# Altium schematic sheet 09- I2C, LEDs And Push Button.SchDoc: I2C LEDs And Push Buttons
size A3; Page Number: 7; Page Size: B; Page Count: 14; Board Rev: B; Project Name: CrossLink-NX Evaluation Board; RevCode: 1.0; Doc: 305-PD-19-0819; DsnPath: C:\Users\HAltinkilit\Downloads\Crosslink-NX-Design-Files\CrossLink-NX-Eval-Brd-Schematic-RevB-191122.DSN; SchematicName: SCHEMATIC1; PageName: 07 - I2C, LEDs And Push Button; PageSize: B; TopSchematic: True
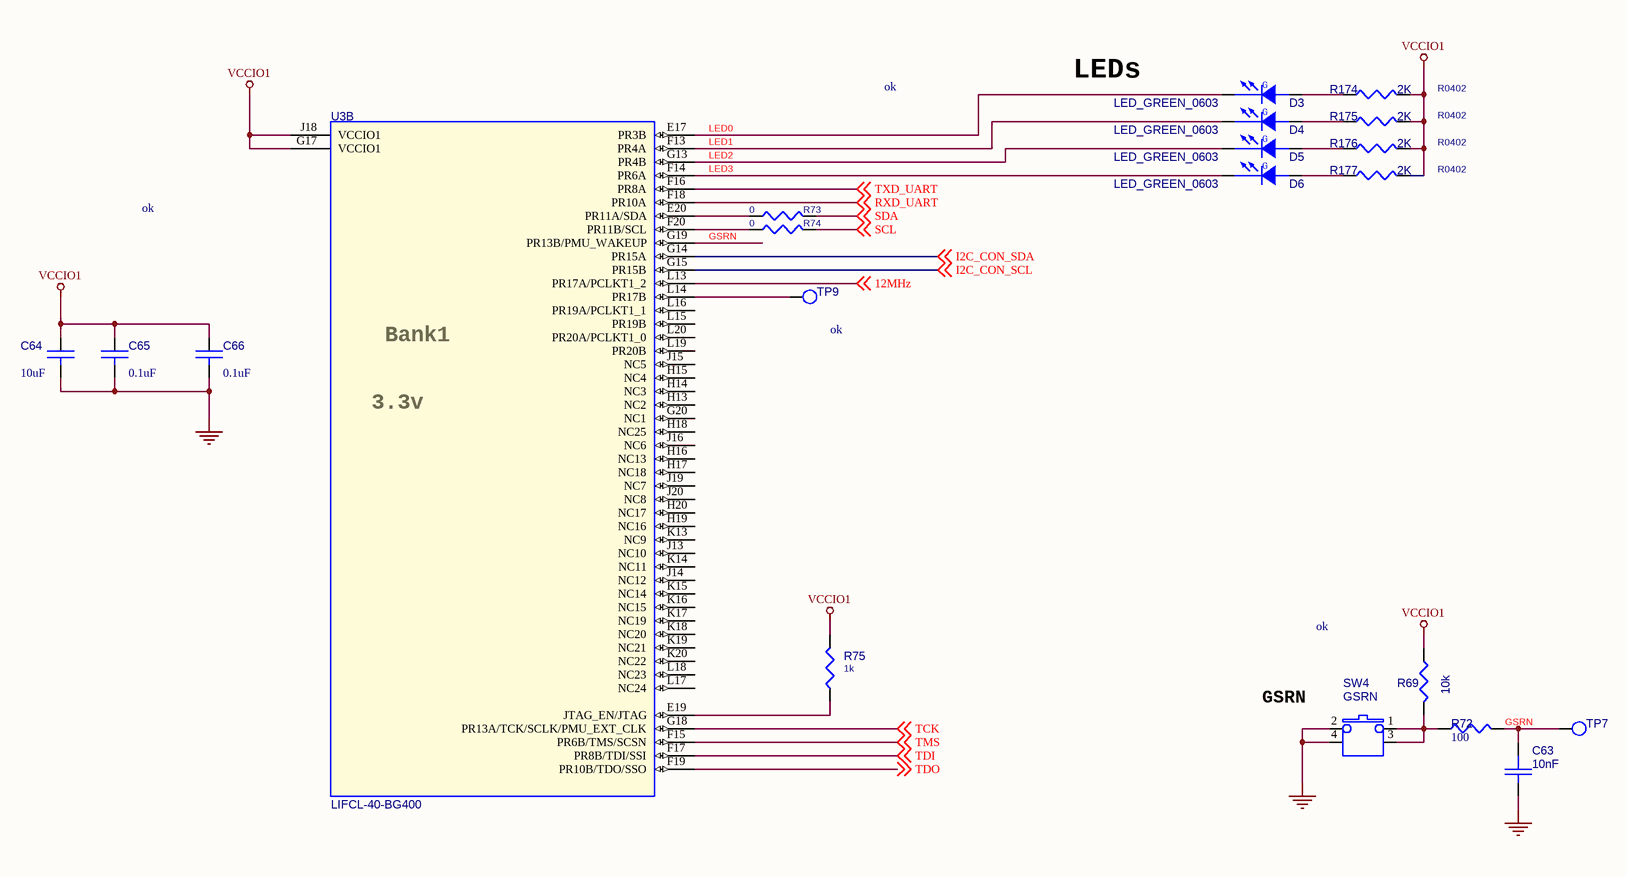
[diagram p0: 09- I2C, LEDs And Push Button.SchDoc]

## Parts
C63  10nF  [RLP-130-A]
C64  10uF  [C0603]
C65  0.1uF  [C0201]
C66  0.1uF  [C0201]
D3  LED_GREEN_0603  [APT1608]
D4  LED_GREEN_0603  [APT1608]
D5  LED_GREEN_0603  [APT1608]
D6  LED_GREEN_0603  [APT1608]
R69  10k  [R0402]
R72  100  [R0402]
R73  0  [R0402]
R74  0  [R0402]
R75  1k  [R0402]
R174  2K  [R0402]
R175  2K  [R0402]
R176  2K  [R0402]
R177  2K  [R0402]
SW4  GSRN  [4psmd_switch]
TP7  TestPoint  [TP_1MM]  (value not drawn)
TP9  TestPoint  [TP_1MM]  (value not drawn)
U3  LIFCL-40-BG400  [LIFCL-40-BG400]  (part B of 15)

## Nets
GND: C63.2 C64.2 C65.2 C66.2 SW4.2 SW4.4
VCCIO1: C64.1 C65.1 C66.1 R69.1 R75.2 R174.2 R175.2 R176.2 R177.2 U3.G17(VCCIO1) U3.J18(VCCIO1)
12MHz: U3.L13(PR17A/PCLKT1_2) ; off-sheet 12MHz
GSRN: C63.1 R72.2 TP7.1(TP) U3.G19(PR13B/PMU_WAKEUP)
I2C_CON_SCL: U3.G15(PR15B) ; off-sheet I2C_CON_SCL
I2C_CON_SDA: U3.G14(PR15A) ; off-sheet I2C_CON_SDA
LED0: D3.1(CATHODE) U3.E17(PR3B)
LED1: D4.1(CATHODE) U3.F13(PR4A)
LED2: D5.1(CATHODE) U3.G13(PR4B)
LED3: D6.1(CATHODE) U3.F14(PR6A)
RXD_UART: U3.F18(PR10A) ; off-sheet RXD_UART
SCL: R74.1 ; off-sheet SCL
SDA: R73.1 ; off-sheet SDA
TCK: U3.G18(PR13A/TCK/SCLK/PMU_EXT_CLK) ; off-sheet TCK
TDI: U3.F17(PR8B/TDI/SSI) ; off-sheet TDI
TDO: U3.F19(PR10B/TDO/SSO) ; off-sheet TDO
TMS: U3.F15(PR6B/TMS/SCSN) ; off-sheet TMS
TXD_UART: U3.F16(PR8A) ; off-sheet TXD_UART
NetD3_2: D3.2(ANODE) R174.1
NetD4_2: D4.2(ANODE) R175.1
NetD5_2: D5.2(ANODE) R176.1
NetD6_2: D6.2(ANODE) R177.1
NetR69_2: R69.2 R72.1 SW4.1 SW4.3
NetR73_2: R73.2 U3.E20(PR11A/SDA)
NetR74_2: R74.2 U3.F20(PR11B/SCL)
NetR75_1: R75.1 U3.E19(JTAG_EN/JTAG)
NetTP9_1: TP9.1(TP) U3.L14(PR17B)

Not connected (* = marked no-connect by the designer): U3 G20(NC1) H13(NC2) H14(NC3) H15(NC4) H16(NC13) H17(NC18) H18(NC25) H19(NC16) H20(NC17) J13(NC10) J14(NC12) J15(NC5) J16(NC6) J19(NC7) J20(NC8) K13(NC9) K14(NC11) K15(NC14) K16(NC15) K17(NC19) K18(NC20) K19(NC21) K20(NC22) L15(PR19B) L16(PR19A/PCLKT1_1) L17(NC24) L18(NC23) L19(PR20B) L20(PR20A/PCLKT1_0)

## Notes on the sheet
- LEDs
- ok
- (near U3) Bank1
- (near TP9) ok
- (near U3) 3.3v
- (near SW4) GSRN
- Proje/Project:
- Sayfa Adı/Document Name:
- Çizilme Tarihi/Drawing Date
- Umit KAYACIK
- Tasarlayan/Designed By
- Sayfa/Sheet:
- Revision:
- of
- Son Güncelleme/Last Edit Date
- Kontrol eden/Checked By
- Onaylayan/Approved By
- Boyut/Size:
- Varyant/Variant:
- Dil/Language:
- A3
- ENG
- (in symbol LED-SMT1206_GREEN_1) G

## Library data of the parts
C63 = CAP_1: Part Reference: C63; Value: 10nF; Assy: -; PCB Footprint: RLP-130-A
C64 = 10uF_0603: CAP CECAP CER 10UF 10V X5R 20% 0603; Manufacturer: Taiyo Yuden; Manufacturer Part Number: LMK107BJ106MALTD; Part Reference: C64; Class: Discrete; Digikey P/N: 587-2562-1-ND; Assy: -; Value: 10uF; PCB Footprint: C0603
C65 = 0u1_0402: CAP CER 0.1UF 25V 10% X5R 0201; Manufacturer: Murata; Manufacturer Part Number: GRM033R61E104KE14J; Part Reference: C65; Class: Discrete; Digikey P/N: 399-3521-2-ND; Assy: -; Value: 0.1uF; PCB Footprint: C0201
C66 = 0u1_0402: CAP CER 0.1UF 25V 10% X5R 0201; Manufacturer: Murata; Manufacturer Part Number: GRM033R61E104KE14J; Part Reference: C66; Class: Discrete; Digikey P/N: 399-3521-2-ND; Assy: -; Value: 0.1uF; PCB Footprint: C0201
D3 = LED-SMT1206_GREEN_1: Part Reference: D3; Value: LED_GREEN_0603; Assy: -; PCB Footprint: APT1608
D4 = LED-SMT1206_GREEN_1: Part Reference: D4; Value: LED_GREEN_0603; Assy: -; PCB Footprint: APT1608
D5 = LED-SMT1206_GREEN_1: Part Reference: D5; Value: LED_GREEN_0603; Assy: -; PCB Footprint: APT1608
D6 = LED-SMT1206_GREEN_1: Part Reference: D6; Value: LED_GREEN_0603; Assy: -; PCB Footprint: APT1608
R69 = RES_0: RES SMD 10K OHM 1% 1/16W 0402; Part Reference: R69; Manufacturer: Yageo; MFG P/N: RC0402FR-0710KL; Value: 10k; MFG: Yageo; Manufacturer Part Number: RC0402FR-0710KL; Assy: -; PCB Footprint: R0402
R72 = 0R_0603: RES SMD 100 OHM 1% 1/16W 0402; Manufacturer: Yageo; Manufacturer Part Number: RC0402FR-07100RL; Part Reference: R72; Class: Discrete; Digikey P/N: 311-0.0GRTR-ND; Assy: -; Value: 100; MFG: Yageo; PCB Footprint: R0402
R73 = R_Dup3: RES SMD 33 OHM 1% 1/10W 0402; Part Reference: R73; Manufacturer: Panasonic; Manufacturer Part Number: ERJ-2RKF33R0X; Value: 0; Assy: -; PCB Footprint: R0402
R74 = R_Dup3: RES SMD 33 OHM 1% 1/10W 0402; Part Reference: R74; Manufacturer: Panasonic; Manufacturer Part Number: ERJ-2RKF33R0X; Value: 0; Assy: -; PCB Footprint: R0402
R75 = RES_100K_1W16_0402_5P: RES 100K OHM 1/10W 1% 0402 SMD; Part Reference: R75; Unit Price (USD): 0.02; Total Area(sq-mm): 0.5; Wattage: 1/16W; DIST: FLAT; MAX_TEMP: RTMAX; MFG P/N: ERJ-2RKF1003X; MFG: Panasonic; TC1: 0; Length(mm): 1; Width(mm): 0.5; TC2: 0; Value: 1k; Assy: -; Manufacturer Part Number: ERJ-2RKF1003X; Manufacturer: Panasonic; PART_NUMBER: ERJ-2RKF1003X; PCB Footprint: R0402
R174 = RES_0: RES SMD 2K OHM 5% 1/10W 0402; Part Reference: R174; Manufacturer Part Number: ERJ-2GEJ202X; MFG: Panasonic; Value: 2K; Manufacturer: Panasonic; MFG P/N: ERJ-2GEJ202X; Assy: -; PCB Footprint: R0402
R175 = RES_0: RES SMD 2K OHM 5% 1/10W 0402; Part Reference: R175; Manufacturer Part Number: ERJ-2GEJ202X; MFG: Panasonic; Value: 2K; Manufacturer: Panasonic; MFG P/N: ERJ-2GEJ202X; Assy: -; PCB Footprint: R0402
R176 = RES_0: RES SMD 2K OHM 5% 1/10W 0402; Part Reference: R176; Manufacturer Part Number: ERJ-2GEJ202X; MFG: Panasonic; Value: 2K; Manufacturer: Panasonic; MFG P/N: ERJ-2GEJ202X; Assy: -; PCB Footprint: R0402
R177 = RES_0: RES SMD 2K OHM 5% 1/10W 0402; Part Reference: R177; Manufacturer Part Number: ERJ-2GEJ202X; MFG: Panasonic; Value: 2K; Manufacturer: Panasonic; MFG P/N: ERJ-2GEJ202X; Assy: -; PCB Footprint: R0402
SW4 = SW PUSHBUTTON-SPST/SM: SWITCH TACTILE SPST-NO 0.05A 12V; Part Reference: SW4; Manufacturer Part Number: 434153017835; MFG: Wurth; Value: GSRN; Assy: -; Man. Part #: 434153017835; Manufacturer: Wurth; MFG P/N: 434153017835; PCB Footprint: 4psmd_switch
TP7 = T POINT R: Part Reference: TP7; PCB Footprint: TP50; Value: TestPoint; Assy: -
TP9 = T POINT R: Part Reference: TP9; PCB Footprint: TP50; Value: TestPoint; Assy: -
U3 = LIFCL-40-BG400: Part Reference: U3; Source Part: LIFCL-40-BG400A.Normal; SWAP_INFO: (S1+S2+S3+S4+S5+S6+S7+S8+S9+S10+S11+S12+S13+S14+S15); SPLIT_INST: TRUE; Name: I17266603; Primitive: DEFAULT; Implementation Type: <none>; Location X-Coordinate: 0; Source Library: C:\USERS\SLIU1\DOCUMENTS\PCB_DESIGN\JEDI_EVAL_BOARD\SCHEMATIC\LIFCL40.OLB; Power Pins Visible: False; Value: LIFCL-40-BG400; Assy: -; Location Y-Coordinate: 0; Color: Default; Source Package: LIFCL-40-BG400; Graphic: LIFCL-40-BG400A.Normal; PCB Footprint: LIFCL-40-BG400